# EAGLE schematic Universal USB-UART Adapter (EAGLE 6.1)
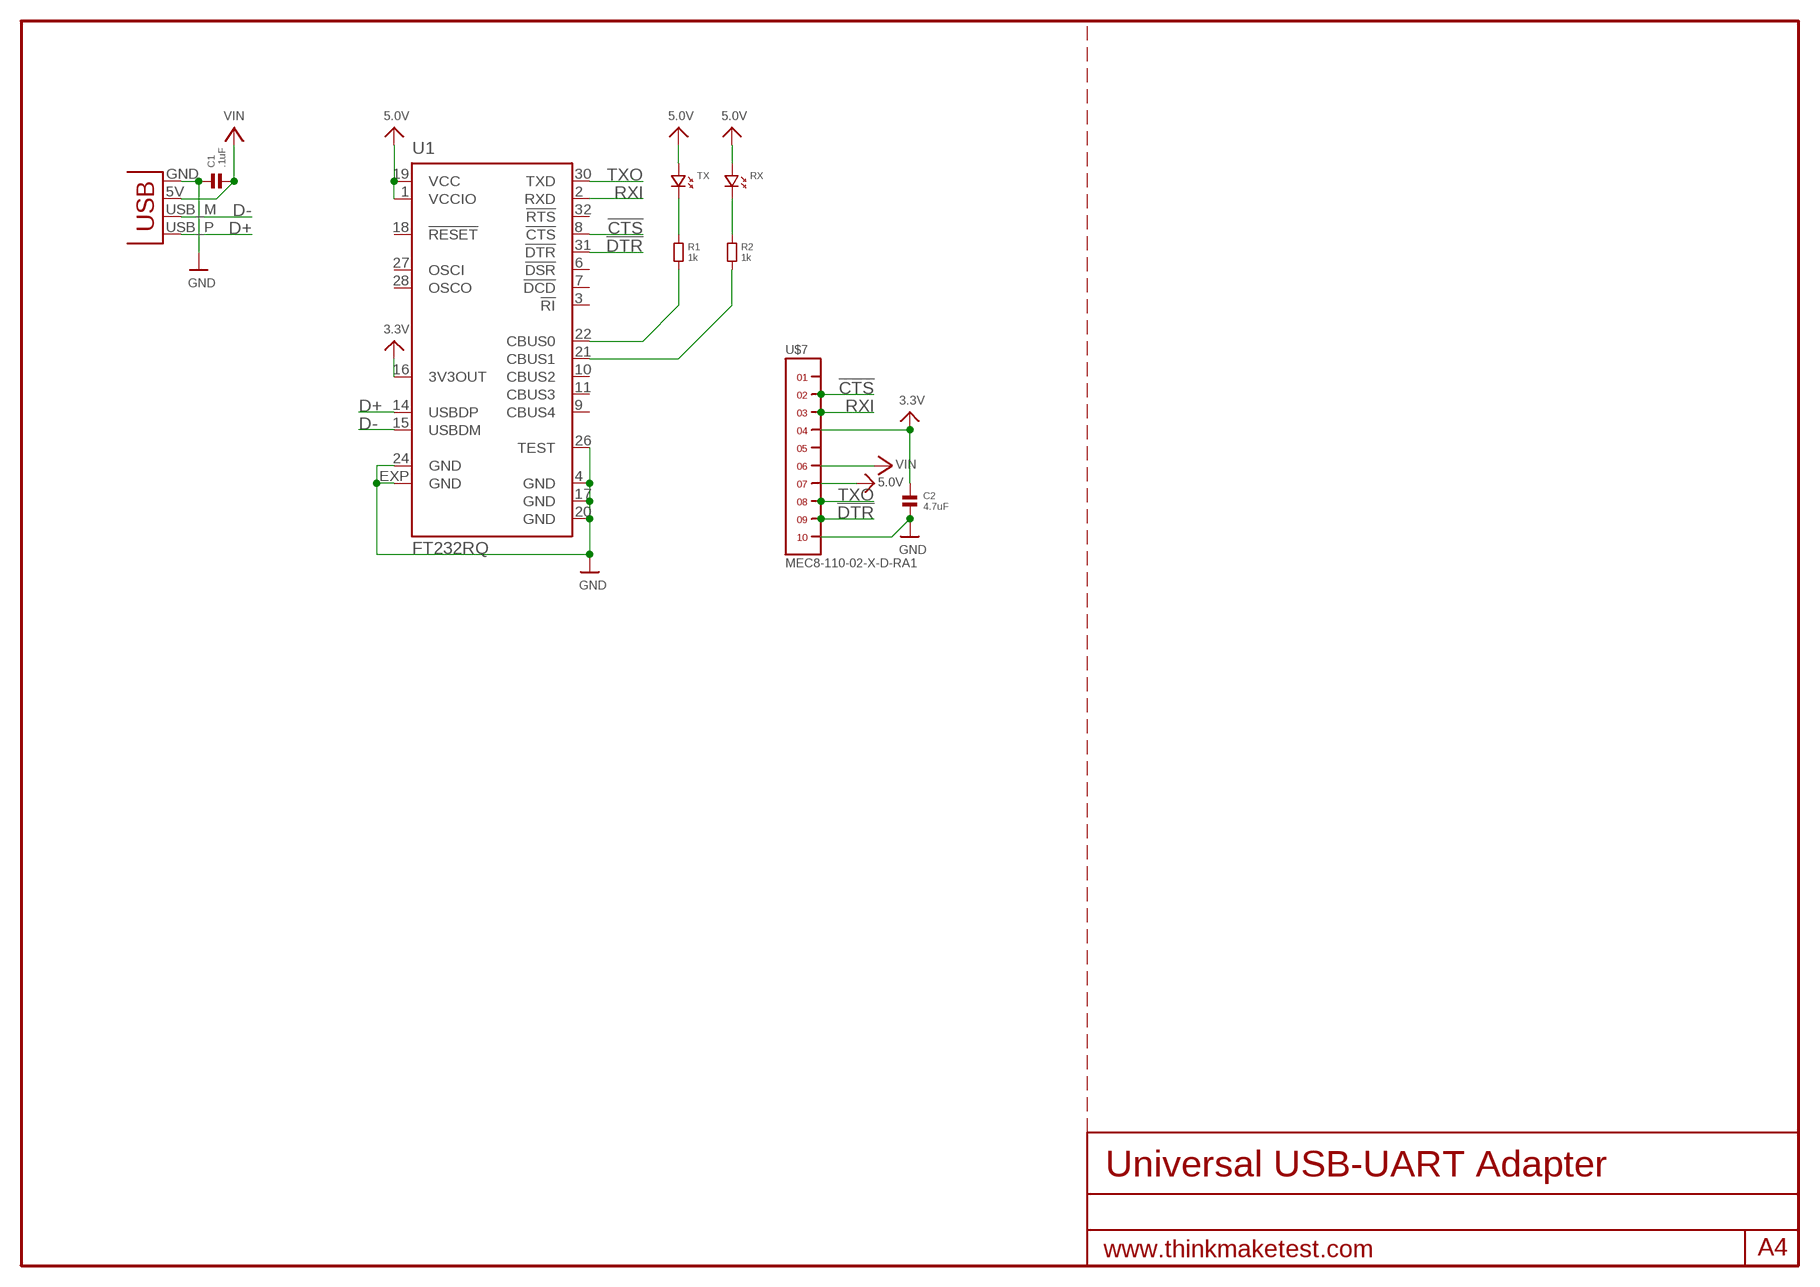
[diagram p0: schematic, sheet 1]

## Parts
C1  .1uF  CAPACITOR.0603  [0603]
C2  4.7uF  CAPACITOR.0603  [0603]
R1  1k  RESISTOR.0603  [0603]
R2  1k  RESISTOR.0603  [0603]
RX  LED.0603  [0603.LED]
TX  LED.0603  [0603.LED]
U1  FT232RQ  [QFN32]
U$7  MEC8-110-02-X-D-RA1  [MEC8-110-02-X-D-RA1]
X1  USBPCB  [USB-A-PCB]

## Nets
3.3V: C2.1 U1.16(3V3OUT) U$7.4 U$7.4@1
5.0V: RX.P$1 TX.P$1 U1.1(VCCIO) U1.19(VCC) U$7.7 U$7.7@1
!CTS: U1.8(!CTS) U$7.2 U$7.2@1
!DTR: U1.31(!DTR) U$7.9 U$7.9@1
D+: U1.14(USBDP) X1.USB_P(D+)
D-: U1.15(USBDM) X1.USB_M(D-)
GND: C1.1 C2.2 U1.4(GND) U1.17(GND) U1.20(GND) U1.24(GND) U1.26(TEST) U1.EXP(GND) U$7.10 U$7.10@1 X1.GND
N$1: R2.1 RX.P$2
N$2: R1.2 U1.22(CBUS0)
N$3: R1.1 TX.P$2
N$4: R2.2 U1.21(CBUS1)
RXI: U1.2(RXD) U$7.3 U$7.3@1
TXO: U1.30(TXD) U$7.8 U$7.8@1
VIN: C1.2 U$7.6 U$7.6@1 X1.5V(VBUS)
Unconnected: U1.3(!RI) U1.6(!DSR) U1.7(!DCD) U1.9(CBUS4) U1.10(CBUS2) U1.11(CBUS3) U1.18(!RESET) U1.27(OSCI) U1.28(OSCO) U1.32(!RTS) U$7.1 U$7.1@1 U$7.5 U$7.5@1

## Library data of the parts
C1 C2 = .standardparts:CAPACITOR
R1 R2 = .standardparts:RESISTOR
RX TX = .standardparts:LED
U1 = ftdichip:FT232R: Source: http://www.ftdichip.com/Documents/DataSheets/DS_FT232R_v104.pdf
U$7 = samtec:MEC8-110-02-X-D-RA1
X1 = SparkFun:USB: USB Connectors USB-B-PTH is fully proven SKU : PRT-00139 USB-miniB is fully proven SKU : PRT-00587 USB-A-PCB is untested. USB-A-H is throughly reviewed, but untested. Spark Fun Electronics SKU : PRT-00437 USB-B-SMT is throughly reviewed, but untested. Needs silkscreen touching up. USB-A-S has not been used/tested USB-MB-H has not been used/tested